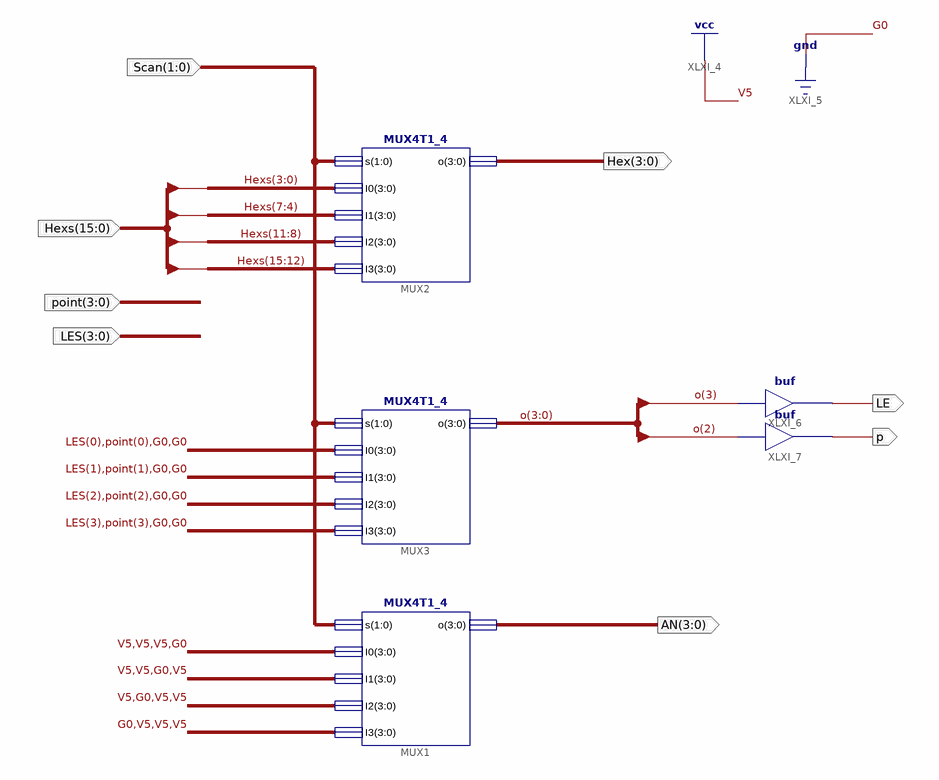
[diagram p0: schematic sheet 1]
// Xilinx ISE schematic ScanSync_sch.sch (kintex7) as structural Verilog: 5 symbols, 8 ports
module ScanSync_sch (
  input  [15:0] Hexs,
  input  [3:0] point,
  input  [3:0] LES,
  input  [1:0] Scan,
  output [3:0] Hex,
  output LE,
  output p,
  output [3:0] AN
);

  wire [3:0] o;

  MUX4T1_4 MUX1 (.s(Scan), .I0(4'b1110), .I1(4'b1101), .I2(4'b1011), .I3(4'b0111), .o(AN));
  MUX4T1_4 MUX2 (.s(Scan), .I0(Hexs[3:0]), .I1(Hexs[7:4]), .I2(Hexs[11:8]), .I3(Hexs[15:12]), .o(Hex));
  MUX4T1_4 MUX3 (
    .s(Scan), .I0({LES[0], point[0], 2'b00}), .I1({LES[1], point[1], 2'b00}), .I2({LES[2], point[2], 2'b00}),
    .I3({LES[3], point[3], 2'b00}), .o(o));
  buf XLXI_6 (LE, o[3]);
  buf XLXI_7 (p, o[2]);
endmodule
